# EAGLE schematic stoichea_v0.1 (EAGLE 9.0.0)
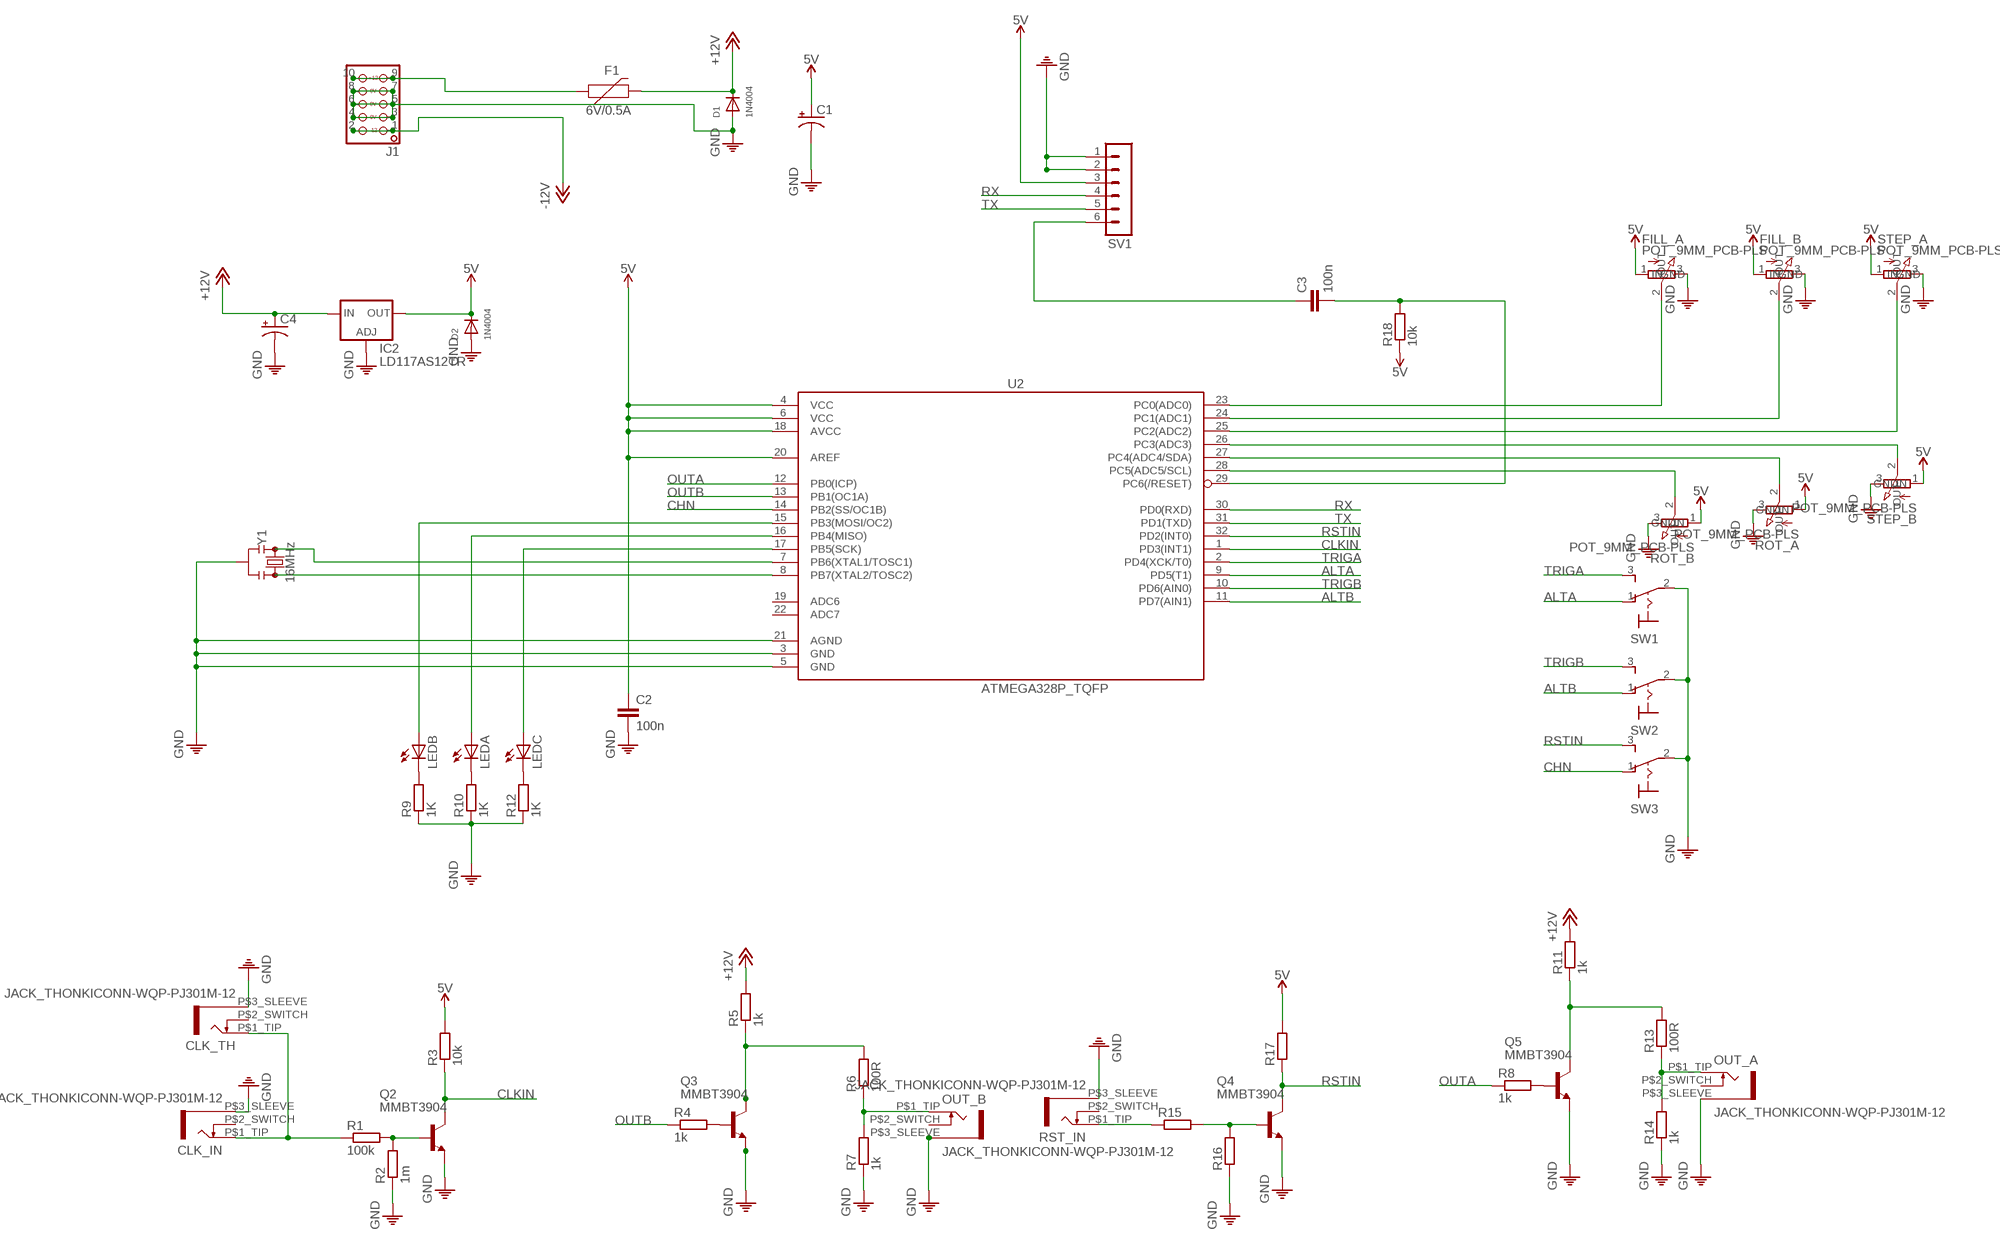
[diagram p0: schematic, sheet 1]

## Parts
C1  CAPACITOR_POLARIZED-USE2.5-5  [E2,5-5]
C2  100n  CAPACITOR-EUC0603K  [C0603K]
C3  100n  CAPACITOR-EUC0603K  [C0603K]
C4  CAPACITOR_POLARIZED-USE2.5-5  [E2,5-5]
CLK_IN  JACK_THONKICONN-WQP-PJ301M-12  [WQP-PJ301M-12_JACK]
CLK_TH  JACK_THONKICONN-WQP-PJ301M-12  [WQP-PJ301M-12_JACK]
D1  1N4004  DIODESOD-323F  [SOD-323F]
D2  1N4004  DIODESOD-323F  [SOD-323F]
F1  6V/0.5A  FUSE-PPTC_HALF-AMP  [1206]
FILL_A  POT_9MM_PCB-PLS  [9MM_PLS]
FILL_B  POT_9MM_PCB-PLS  [9MM_PLS]
IC2  LD117AS12TR  [SOT223]
J1  HEADER-EUROPWR_2X05-OPEN  [2X05_EUROPWR_OPEN]
LEDA  LED3MM  [LED3MM]
LEDB  LED3MM  [LED3MM]
LEDC  LED3MM  [LED3MM]
OUT_A  JACK_THONKICONN-WQP-PJ301M-12  [WQP-PJ301M-12_JACK]
OUT_B  JACK_THONKICONN-WQP-PJ301M-12  [WQP-PJ301M-12_JACK]
Q2  MMBT3904  TRANSISTOR-NPN-MMBT3904LT1SOT23-BEC  [SOT23-BEC]
Q3  MMBT3904  TRANSISTOR-NPN-MMBT3904LT1SOT23-BEC  [SOT23-BEC]
Q4  MMBT3904  TRANSISTOR-NPN-MMBT3904LT1SOT23-BEC  [SOT23-BEC]
Q5  MMBT3904  TRANSISTOR-NPN-MMBT3904LT1SOT23-BEC  [SOT23-BEC]
R1  100k  RESISTOR-EU_R0603  [R0603]
R2  1m  RESISTOR-EU_R0603  [R0603]
R3  10k  RESISTOR-EU_R0603  [R0603]
R4  1k  RESISTOR-EU_R0603  [R0603]
R5  1k  RESISTOR-EU_R0603  [R0603]
R6  100R  RESISTOR-EU_R0603  [R0603]
R7  1k  RESISTOR-EU_R0603  [R0603]
R8  1k  RESISTOR-EU_R0603  [R0603]
R9  1K  RESISTOR-EU_R0603  [R0603]
R10  1K  RESISTOR-EU_R0603  [R0603]
R11  1k  RESISTOR-EU_R0603  [R0603]
R12  1K  RESISTOR-EU_R0603  [R0603]
R13  100R  RESISTOR-EU_R0603  [R0603]
R14  1k  RESISTOR-EU_R0603  [R0603]
R15  RESISTOR-EU_R0603  [R0603]
R16  RESISTOR-EU_R0603  [R0603]
R17  RESISTOR-EU_R0603  [R0603]
R18  10k  RESISTOR-EU_R0603  [R0603]
ROT_A  POT_9MM_PCB-PLS  [9MM_PLS]
ROT_B  POT_9MM_PCB-PLS  [9MM_PLS]
RST_IN  JACK_THONKICONN-WQP-PJ301M-12  [WQP-PJ301M-12_JACK]
STEP_A  POT_9MM_PCB-PLS  [9MM_PLS]
STEP_B  POT_9MM_PCB-PLS  [9MM_PLS]
SV1  MA06-1  [MA06-1]
SW1  SWITCH-SPDT-320-916  [320-916]
SW2  SWITCH-SPDT-320-916  [320-916]
SW3  SWITCH-SPDT-320-916  [320-916]
U2  ATMEGA328P_TQFP  [TQFP32-08]
Y1  16MHz  RESONATORSMD-3.2X1.3  [RESONATOR-SMD-3.2X1.3]

## Nets
5V: C1.+ C2.1 D2.C FILL_A.1(GND) FILL_B.1(GND) IC2.4(OUT) R3.2 R17.2 R18.1 ROT_A.1(GND) ROT_B.1(GND) STEP_A.1(GND) STEP_B.1(GND) SV1.3 U2.4(VCC) U2.6(VCC) U2.18(AVCC) U2.20(AREF)
+12V: C4.+ D1.C F1.2 IC2.3(IN) R5.2 R11.2
-12V: J1.1 J1.2
ALTA: SW1.1(O) U2.9(PD5(T1))
ALTB: SW2.1(O) U2.11(PD7(AIN1))
CHN: SW3.1(O) U2.14(PB2(SS/OC1B))
CLKIN: Q2.C R3.1 U2.1(PD3(INT1))
N$1: LEDB.K(C) R9.2
N$2: LEDA.K(C) R10.2
N$3: LEDC.K(C) R12.2
N$4: LEDB.A U2.15(PB3(MOSI/OC2))
N$5: LEDA.A U2.16(PB4(MISO))
N$6: LEDC.A U2.17(PB5(SCK))
N$8: CLK_IN.P$1_TIP CLK_TH.P$1_TIP R1.1
N$9 [GND]: F1.1 J1.9 J1.10
N$11: Q2.B R1.2 R2.2
N$12: Q3.B R4.2
N$13: Q3.C R5.1 R6.2
N$14: OUT_B.P$1_TIP R6.1 R7.2
N$15: Q5.B R8.2
N$16: Q5.C R11.1 R13.2
N$17: OUT_A.P$1_TIP R13.1 R14.2
N$18: R15.1 RST_IN.P$1_TIP
N$19: C3.2 R18.2 U2.29(PC6(/RESET))
N$20: Q4.B R15.2 R16.2
N$21: C3.1 SV1.6
N$22: FILL_A.2(OUT) U2.23(PC0(ADC0))
N$23: FILL_B.2(OUT) U2.24(PC1(ADC1))
N$24: STEP_A.2(OUT) U2.25(PC2(ADC2))
N$25: STEP_B.2(OUT) U2.26(PC3(ADC3))
N$26: ROT_A.2(OUT) U2.27(PC4(ADC4/SDA))
N$27: ROT_B.2(OUT) U2.28(PC5(ADC5/SCL))
N$28: U2.8(PB7(XTAL2/TOSC2)) Y1.3
N$29: U2.7(PB6(XTAL1/TOSC1)) Y1.1
OUTA: R8.1 U2.12(PB0(ICP))
OUTB: R4.1 U2.13(PB1(OC1A))
PE: C1.- C2.2 C4.- CLK_IN.P$3_SLEEVE CLK_TH.P$3_SLEEVE D1.A D2.A FILL_A.3(IN) FILL_B.3(IN) IC2.1(ADJ) J1.3 J1.4 J1.5 J1.6 J1.7 J1.8 OUT_A.P$3_SLEEVE OUT_B.P$3_SLEEVE Q2.E Q3.E Q4.E Q5.E R2.1 R7.1 R9.1 R10.1 R12.1 R14.1 R16.1 ROT_A.3(IN) ROT_B.3(IN) RST_IN.P$3_SLEEVE STEP_A.3(IN) STEP_B.3(IN) SV1.1 SV1.2 SW1.2(P) SW2.2(P) SW3.2(P) U2.3(GND) U2.5(GND) U2.21(AGND) Y1.2 ; supply symbol labelled GND
RSTIN: Q4.C R17.1 SW3.3(S) U2.32(PD2(INT0))
RX: SV1.4 U2.30(PD0(RXD))
TRIGA: SW1.3(S) U2.2(PD4(XCK/T0))
TRIGB: SW2.3(S) U2.10(PD6(AIN0))
TX: SV1.5 U2.31(PD1(TXD))
Unconnected: CLK_IN.P$2_SWITCH CLK_TH.P$2_SWITCH OUT_A.P$2_SWITCH OUT_B.P$2_SWITCH RST_IN.P$2_SWITCH U2.19(ADC6) U2.22(ADC7)

## Library data of the parts
C1 C4 = 0000-master:CAPACITOR_POLARIZED-US: POLARIZED CAPACITOR, American symbol
C2 C3 = 0000-master:CAPACITOR-EU: CAPACITOR, European symbol
CLK_IN CLK_TH OUT_A OUT_B RST_IN = 0000-master:JACK_THONKICONN-WQP-PJ301M-12
D1 D2 = adafruit:DIODE: Diode SMADIODE - SMA Surface Mount Package 20V 1A Schottky Diode Digikey: 641-1014-6-ND DO-1N4148 - Through Hole Small Current Diode SOD-123 20V 1 A (.5mV Vf) Schottky Diode - Digikey: MBRX120TPMSCT-ND SOD-323 10V 570mA (.38mV Vf, 3ns) Schottky Diode - Digikey: ZLLS410CT-ND SOD-523 30V 30mA Schottky Diode (RB751S-40TE61) - Digikey: RB751S-40TE61CT-ND SOT23-R/W - SOT23 Package (R = Solder Paste/Reflow Ovens, W = Hand-Soldering) BAT54Film 40V 300mA - Digikey: 497-7162-1-ND
F1 = 0000-master:FUSE-PPTC: Resettable Fuse PPTC Resettable Fuse. Really a sort of resistor with a polymeric positive temperature coefficient whose resistance increases dramatically with an increase in temperature. When heated by the power passing through the resistance rises causing the current to be limited, protecting the circuit. This is achieved by the transition of the polymer from a crystalline to an amorphous state where the conductive carbon separates breaking the conductive pathways found in the cool crystalline structure. When a PPTC cools back down it resumes conducting letting the circuit turn back on. SparkFun Products: SparkFun RedBoard - Programmed with Arduino <https://www.sparkfun.com/products/12757> Pro Micro - 5V/16MHz <https://www.sparkfun.com/products/12640> Arduino Pro 328 - 5V/16MHz <https://www.sparkfun.com/products/10915> MP3 Trigger <https://www.sparkfun.com/products/13720>; PROD_ID: RES-08585
FILL_A FILL_B ROT_A ROT_B STEP_A STEP_B = 0000-master:POT_9MM_PCB: 9 mm Square Rotary Potentiometers Source: Panasonic
IC2 = v-reg:LD117A?*: Low drop fixed and adjustable positive voltage regulators 1 A Source: http://www.st.com/stonline/products/literature/ds/7194/ld1117axx.pdf
J1 = 0000-master:HEADER-EUROPWR_2X05: 2x05 pin header
LEDA LEDB LEDC = 0000-master:LED: LED OSRAM: - CHIPLED LG R971, LG N971, LY N971, LG Q971, LY Q971, LO R971, LY R971 LH N974, LH R974 LS Q976, LO Q976, LY Q976 LO Q996 - Hyper CHIPLED LW Q18S LB Q993, LB Q99A, LB R99A - SideLED LS A670, LO A670, LY A670, LG A670, LP A670 LB A673, LV A673, LT A673, LW A673 LH A674 LY A675 LS A676, LA A676, LO A676, LY A676, LW A676 LS A679, LY A679, LG A679 - Hyper Micro SIDELED® LS Y876, LA Y876, LO Y876, LY Y876 LT Y87S - SmartLED LW L88C, LW L88S LB L89C, LB L89S, LG L890 LS L89K, LO L89K, LY L89K LS L896, LA L896, LO L896, LY L896 - TOPLED LS T670, LO T670, LY T670, LG T670, LP T670 LSG T670, LSP T670, LSY T670, LOP T670, LYG T670 LG T671, LOG T671, LSG T671 LB T673, LV T673, LT T673, LW T673 LH T674 LS T676, LA T676, LO T676, LY T676, LB T676, LH T676, LSB T676, LW T676 LB T67C, LV T67C, LT T67C, LS T67K, LO T67K, LY T67K, LW E67C LS E67B, LA E67B, LO E67B, LY E67B, LB E67C, LV E67C, LT E67C LW T67C LS T679, LY T679, LG T679 LS T770, LO T770, LY T770, LG T770, LP T770 LB T773, LV T773, LT T773, LW T773 LH T774 LS E675, LA E675, LY E675, LS T675 LS T776, LA T776, LO T776, LY T776, LB T776 LHGB T686 LT T68C, LB T68C - Hyper Mini TOPLED® LB M676 - Mini TOPLED Santana® LG M470 LS M47K, LO M47K, LY M47K Source: http://www.osram.convergy.de LUXEON: - LUMILED® LXK2-PW12-R00, LXK2-PW12-S00, LXK2-PW14-U00, LXK2-PW14-V00 LXK2-PM12-R00, LXK2-PM12-S00, LXK2-PM14-U00 LXK2-PE12-Q00, LXK2-PE12-R00, LXK2-PE12-S00, LXK2-PE14-T00, LXK2-PE14-U00 LXK2-PB12-K00, LXK2-PB12-L00, LXK2-PB12-M00, LXK2-PB14-N00, LXK2-PB14-P00, LXK2-PB14-Q00 LXK2-PR12-L00, LXK2-PR12-M00, LXK2-PR14-Q00, LXK2-PR14-R00 LXK2-PD12-Q00, LXK2-PD12-R00, LXK2-PD12-S00 LXK2-PH12-R00, LXK2-PH12-S00 LXK2-PL12-P00, LXK2-PL12-Q00, LXK2-PL12-R00 Source: www.luxeon.com KINGBRIGHT: KA-3528ASYC Source: www.kingbright.com
Q2-Q5 = 0000-master:TRANSISTOR-NPN-: NPN Transistror BF959 corrected 2008.03.06
R1-R18 = 0000-master:RESISTOR-EU_: RESISTOR, European symbol
SV1 = con-lstb:MA06-1: PIN HEADER; OC_FARNELL: unknown; OC_NEWARK: unknown
SW1-SW3 = 0000-master:SWITCH-SPDT-320-916: TOGGLE SWITCH distributor RS Components
U2 = SparkFun-IC-Microcontroller:ATMEGA328P_TQFP: Popular 328P in QFP Storefront component: ATmega328 - TQFP <https://www.sparkfun.com/products/13448> (COM-13448) Datasheet <http://www.sparkfun.com/datasheets/Components/SMD/ATMega328.pdf> SparkFun Products SparkFun RedBoard - Programmed with Arduino <https://www.sparkfun.com/products/12757> (DEV-12757) Arduino Pro Mini 328 - 5V/16MHz <https://www.sparkfun.com/products/11113> (DEV-11113) Arduino Pro Mini 328 - 3.3V/8MHz <https://www.sparkfun.com/products/11114> (DEV-11114) SparkFun OpenLog <https://www.sparkfun.com/products/13712> (DEV-13712) SparkFun MicroView - OLED Arduino Module <https://www.sparkfun.com/products/12923> (DEV-12923) SparkFun Digital Sandbox <https://www.sparkfun.com/products/12651> (DEV-12651) SparkFun PicoBoard <https://www.sparkfun.com/products/11888> (WIG-11888) Arduino Fio <https://www.sparkfun.com/products/10116> (DEV-10116) LilyPad Arduino 328 Main Board <https://www.sparkfun.com/products/13342> (DEV-13342) SparkFun RedStick <https://www.sparkfun.com/products/13741> (DEV-13741) LilyPad MP3 <https://www.sparkfun.com/products/11013> (DEV-11013) LilyPad Arduino SimpleSnap <https://www.sparkfun.com/products/10941> (DEV-10941) SparkFun Stepoko <https://www.sparkfun.com/products/13899> (ROB-13899) SparkFun Geiger Counter <https://www.sparkfun.com/products/11345> (SEN-11345) SparkFun EL Sequencer <https://www.sparkfun.com/products/12781> (COM-12781) Arduino Pro 328 - 5V/16MHz <https://www.sparkfun.com/products/10915> (DEV-10915) CryptoCape <https://www.sparkfun.com/products/12773> (DEV-12773) SparkFun IR Thermometer Evaluation Board - MLX90614 <https://www.sparkfun.com/products/10740> (SEN-10740) SparkFun RedBot Mainboard <https://www.sparkfun.com/products/12097> (ROB-12097) Arduino Pro 328 - 3.3V/8MHz <https://www.sparkfun.com/products/10914> (DEV-10914) SparkFun Block for Intel® Edison - Arduino <https://www.sparkfun.com/products/13036> (DEV-13036) SparkFun Simon Says - Surface Mount Soldering Kit <https://www.sparkfun.com/products/10935> (KIT-10935) SparkFun 7-Segment Serial Display - Red <https://www.sparkfun.com/products/11441> (COM-11441) SparkFun 7-Segment Serial Display - White <https://www.sparkfun.com/products/11629> (COM-11629) SparkFun 7-Segment Serial Display - Yellow <https://www.sparkfun.com/products/11443> (COM-11443) SparkFun 7-Segment Serial Display - Kelly Green <https://www.sparkfun.com/products/11440> (COM-11440) SparkFun 7-Segment Serial Display - Blue <https://www.sparkfun.com/products/11442> (COM-11442) SparkFun OpenSegment Serial Display - 20mm (Blue) <https://www.sparkfun.com/products/11647> (COM-11647) SparkFun OpenSegment Serial Display - 20mm (Green) <https://www.sparkfun.com/products/11646> (COM-11646) SparkFun OpenSegment Serial Display - 20mm (White) <https://www.sparkfun.com/products/11648> (COM-11648) SparkFun OpenSegment Serial Display - 20mm (Red) <https://www.sparkfun.com/products/11644> (COM-11644) SparkFun OpenSegment Serial Display - 20mm (Yellow) <https://www.sparkfun.com/products/11645> (COM-11645) SparkFun OpenSegment Shield <https://www.sparkfun.com/products/13190> (DEV-13190); PROD_ID: IC-09069
Y1 = 0000-master:RESONATOR: Resonators (Generic) Ceramic resonators are clock-generating components, often used to control timing in microcontrollers. They usually have 3 pins: two pins for oscillation, and one pin for ground. Compared to crystals, resonators have worse tolerance, but are usually much cheaper. Plus, they have built-in load capacitors! These devices are used on boards like the Arduino Pro 8MHz <https://www.sparkfun.com/products/11114> and Arduino Pro 16MHz <https://www.sparkfun.com/products/11113>.

## Net classes
0 default: width 0.203 mm
1 GND: width 0.305 mm